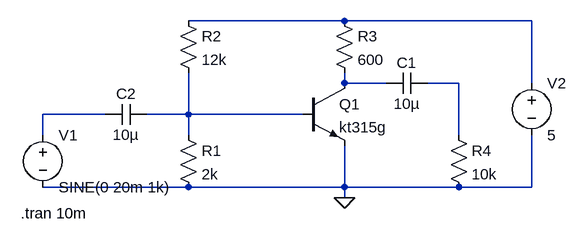
[diagram p0: schematic 4_1.asc]
4_1.asc, the LTspice schematic file:
Version 4
SHEET 1 880 680
WIRE 144 -32 -96 -32
WIRE 432 -32 144 -32
WIRE 144 64 144 48
WIRE 208 64 144 64
WIRE 320 64 272 64
WIRE 432 64 432 -32
WIRE -224 112 -320 112
WIRE -96 112 -96 48
WIRE -96 112 -160 112
WIRE 80 112 -96 112
WIRE -320 144 -320 112
WIRE -96 144 -96 112
WIRE 320 144 320 64
WIRE -96 224 -320 224
WIRE 144 224 144 160
WIRE 144 224 -96 224
WIRE 320 224 144 224
WIRE 432 224 432 144
WIRE 432 224 320 224
WIRE 144 240 144 224
FLAG 144 240 0
SYMBOL npn 80 64 R0
SYMATTR InstName Q1
SYMATTR Value kt315g
SYMBOL res -112 128 R0
SYMATTR InstName R1
SYMATTR Value 2k
SYMBOL res -112 -48 R0
SYMATTR InstName R2
SYMATTR Value 12k
SYMBOL res 128 -48 R0
SYMATTR InstName R3
SYMATTR Value 600
SYMBOL res 304 128 R0
SYMATTR InstName R4
SYMATTR Value 10k
SYMBOL cap 272 48 R90
WINDOW 0 0 32 VBottom 2
WINDOW 3 32 32 VTop 2
SYMATTR InstName C1
SYMATTR Value 10µ
SYMBOL cap -160 96 R90
WINDOW 0 0 32 VBottom 2
WINDOW 3 32 32 VTop 2
SYMATTR InstName C2
SYMATTR Value 10µ
SYMBOL voltage -320 128 R0
WINDOW 123 0 0 Left 2
WINDOW 39 0 0 Left 2
SYMATTR InstName V1
SYMATTR Value SINE(0 20m 1k)
SYMBOL voltage 432 48 R0
WINDOW 123 0 0 Left 2
WINDOW 39 0 0 Left 2
SYMATTR InstName V2
SYMATTR Value 5
TEXT -354 264 Left 2 !.tran 10m

The netlist it stands for:
* 4_1.asc
Q1 N002 N005 0 0 kt315g
R1 N005 0 2k
R2 N001 N005 12k
R3 N001 N002 600
R4 N003 0 10k
C1 N003 N002 10µ
C2 N005 N004 10µ
V1 N004 0 SINE(0 20m 1k)
V2 N001 0 5
.model NPN NPN
.model PNP PNP
.lib standard.bjt
.tran 10m
.backanno
.end